# EAGLE design profile (EAGLE 7.7.0)
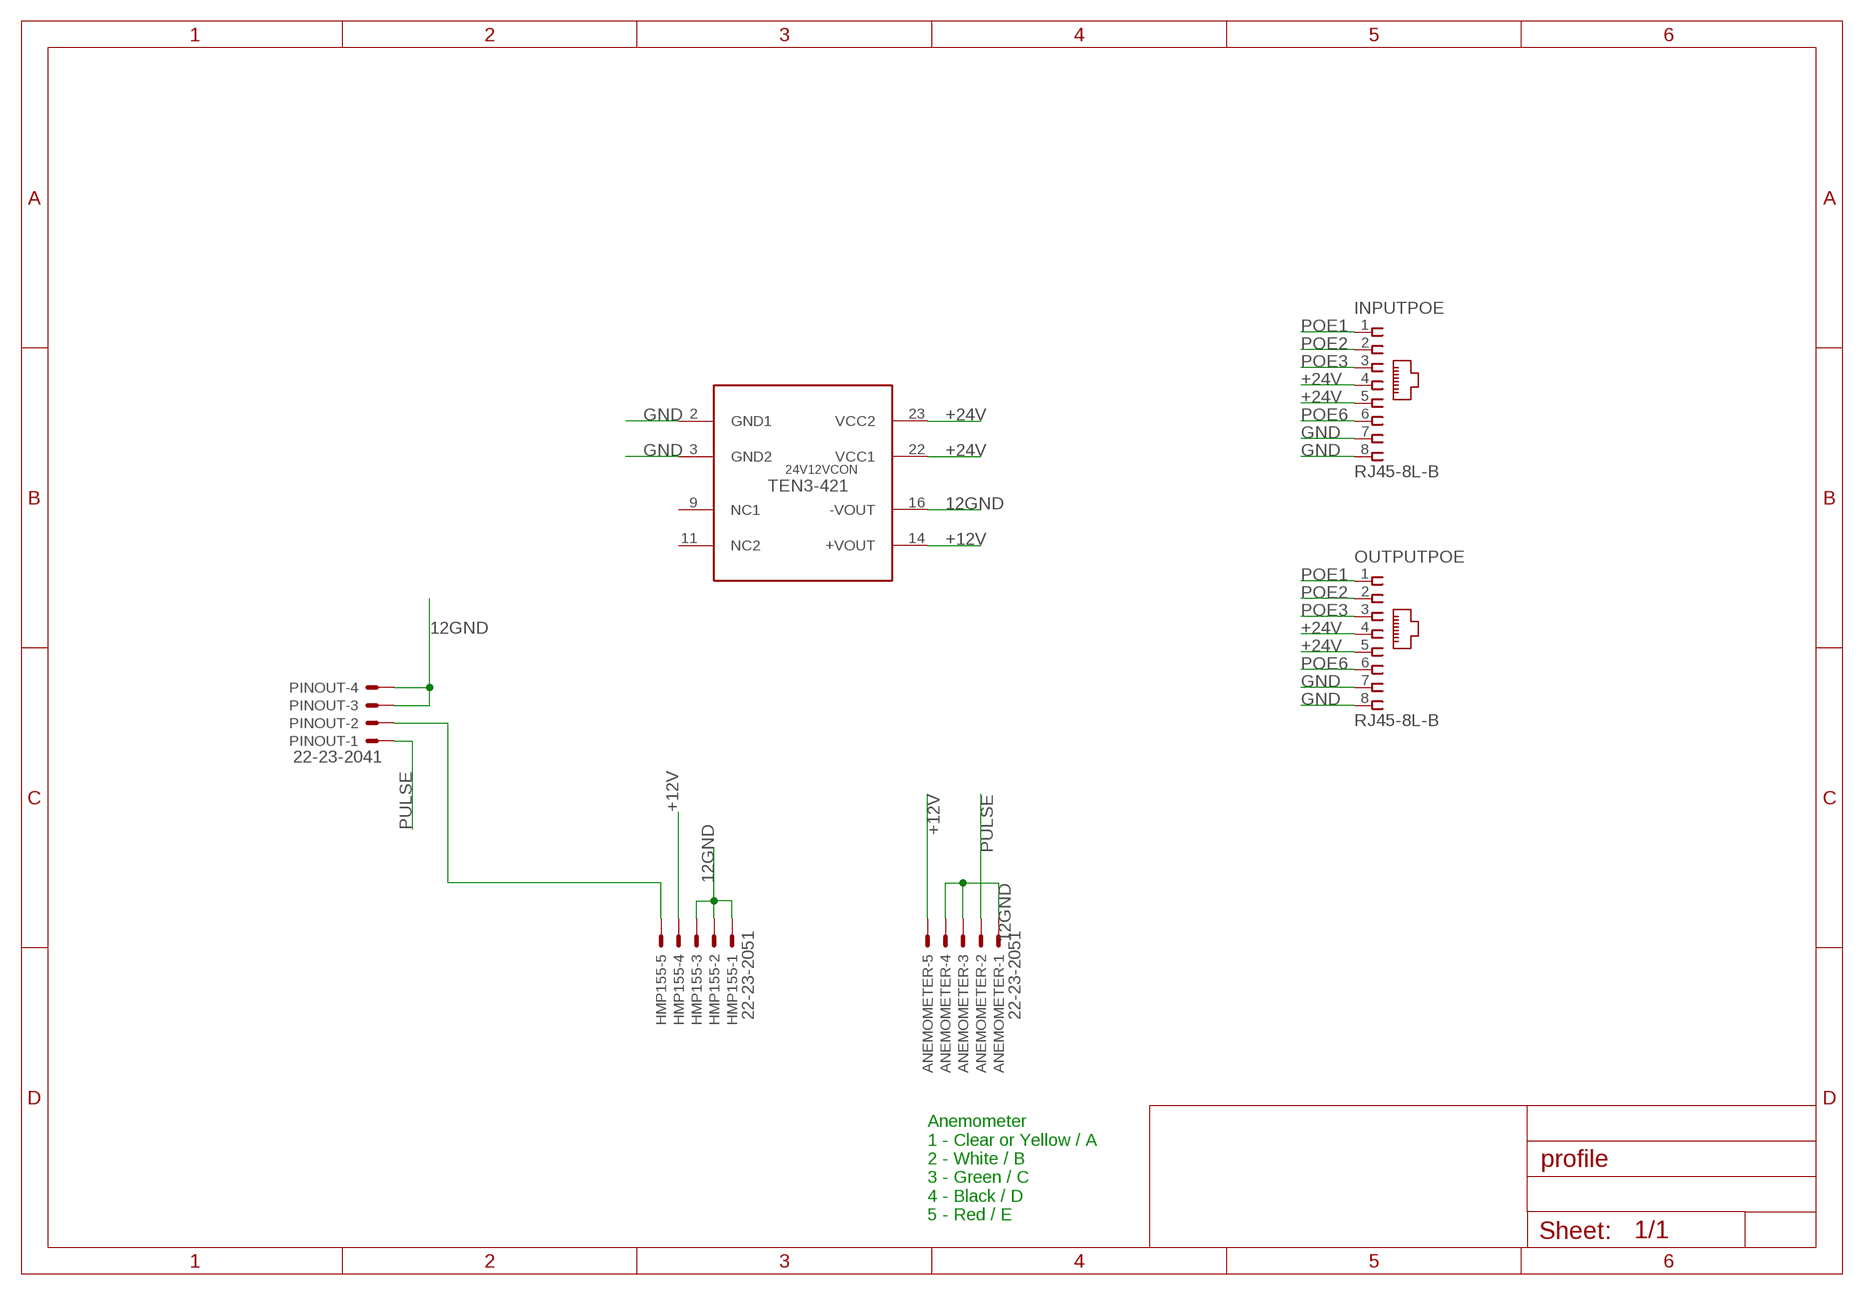
[diagram p0: schematic, sheet 1]

## Parts
24V12VCON  TEN3-421  [SOCKET-24-6]
ANEMOMETER  22-23-2051  [22-23-2051]
HMP155  22-23-2051  [22-23-2051]
INPUTPOE  RJ45-8L-B  [RJ45-NO-SHIELD]
OUTPUTPOE  RJ45-8L-B  [RJ45-NO-SHIELD]
PINOUT  22-23-2041  [22-23-2041]

## Nets
12GND: 24V12VCON.16(-VOUT) ANEMOMETER.1 ANEMOMETER.3 ANEMOMETER.4 HMP155.1 HMP155.2 HMP155.3 PINOUT.3 PINOUT.4
+12V: 24V12VCON.14(+VOUT) ANEMOMETER.5 HMP155.4
+24V: 24V12VCON.22(VCC1) 24V12VCON.23(VCC2) INPUTPOE.4 INPUTPOE.5 OUTPUTPOE.4 OUTPUTPOE.5
GND: 24V12VCON.2(GND1) 24V12VCON.3(GND2) INPUTPOE.7 INPUTPOE.8 OUTPUTPOE.7 OUTPUTPOE.8
N$4: HMP155.5 PINOUT.2
POE1: INPUTPOE.1 OUTPUTPOE.1
POE2: INPUTPOE.2 OUTPUTPOE.2
POE3: INPUTPOE.3 OUTPUTPOE.3
POE6: INPUTPOE.6 OUTPUTPOE.6
PULSE: ANEMOMETER.2 PINOUT.1
Unconnected: 24V12VCON.9(NC1) 24V12VCON.11(NC2)

## Notes on the sheet
- Anemometer
  1 - Clear or Yellow / A
  2 - White / B
  3 - Green / C
  4 - Black / D
  5 - Red / E

## Library data of the parts
24V12VCON = TRACO:TEN3-421
ANEMOMETER HMP155 = con-molex:22-23-2051: .100" (2.54mm) Center Header - 5 Pin; MF: MOLEX; MPN: 22-23-2051; OC_FARNELL: 1462952; OC_NEWARK: 38C9178
INPUTPOE OUTPUTPOE = con-tycoelectronics:RJ45: CORCOM Modular RJ Jacks No Shield Source: www.tycoelectronics.com .. ENG_DS_1654001_1099_RJ_L_0507.pdf; MF: TYCO ELECTRONICS; MPN: RJ45-8L-B; OC_FARNELL: 1279843; OC_NEWARK: 52K4445
PINOUT = con-molex:22-23-2041: .100" (2.54mm) Center Header - 4 Pin; MF: MOLEX; MPN: 22-23-2041; OC_FARNELL: 1462920; OC_NEWARK: 38C0355

## Net classes
0 default: width 0.152 mm, clearance 0.254 mm

## Board
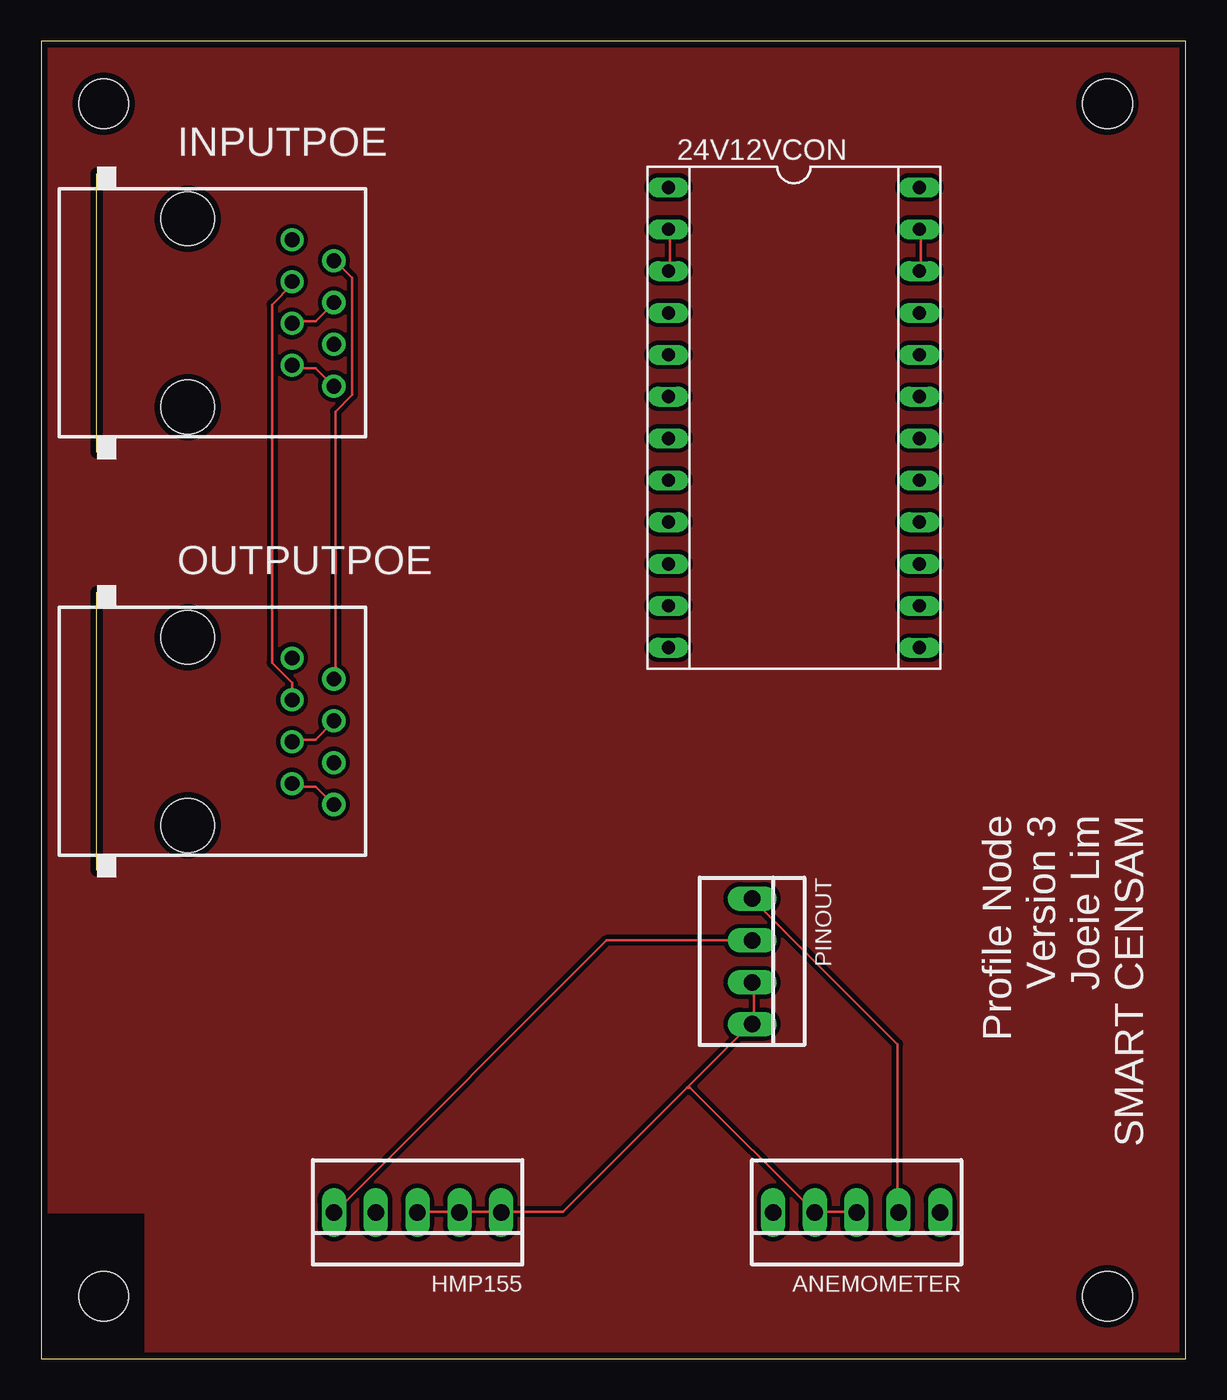
[diagram p1: board, top side]
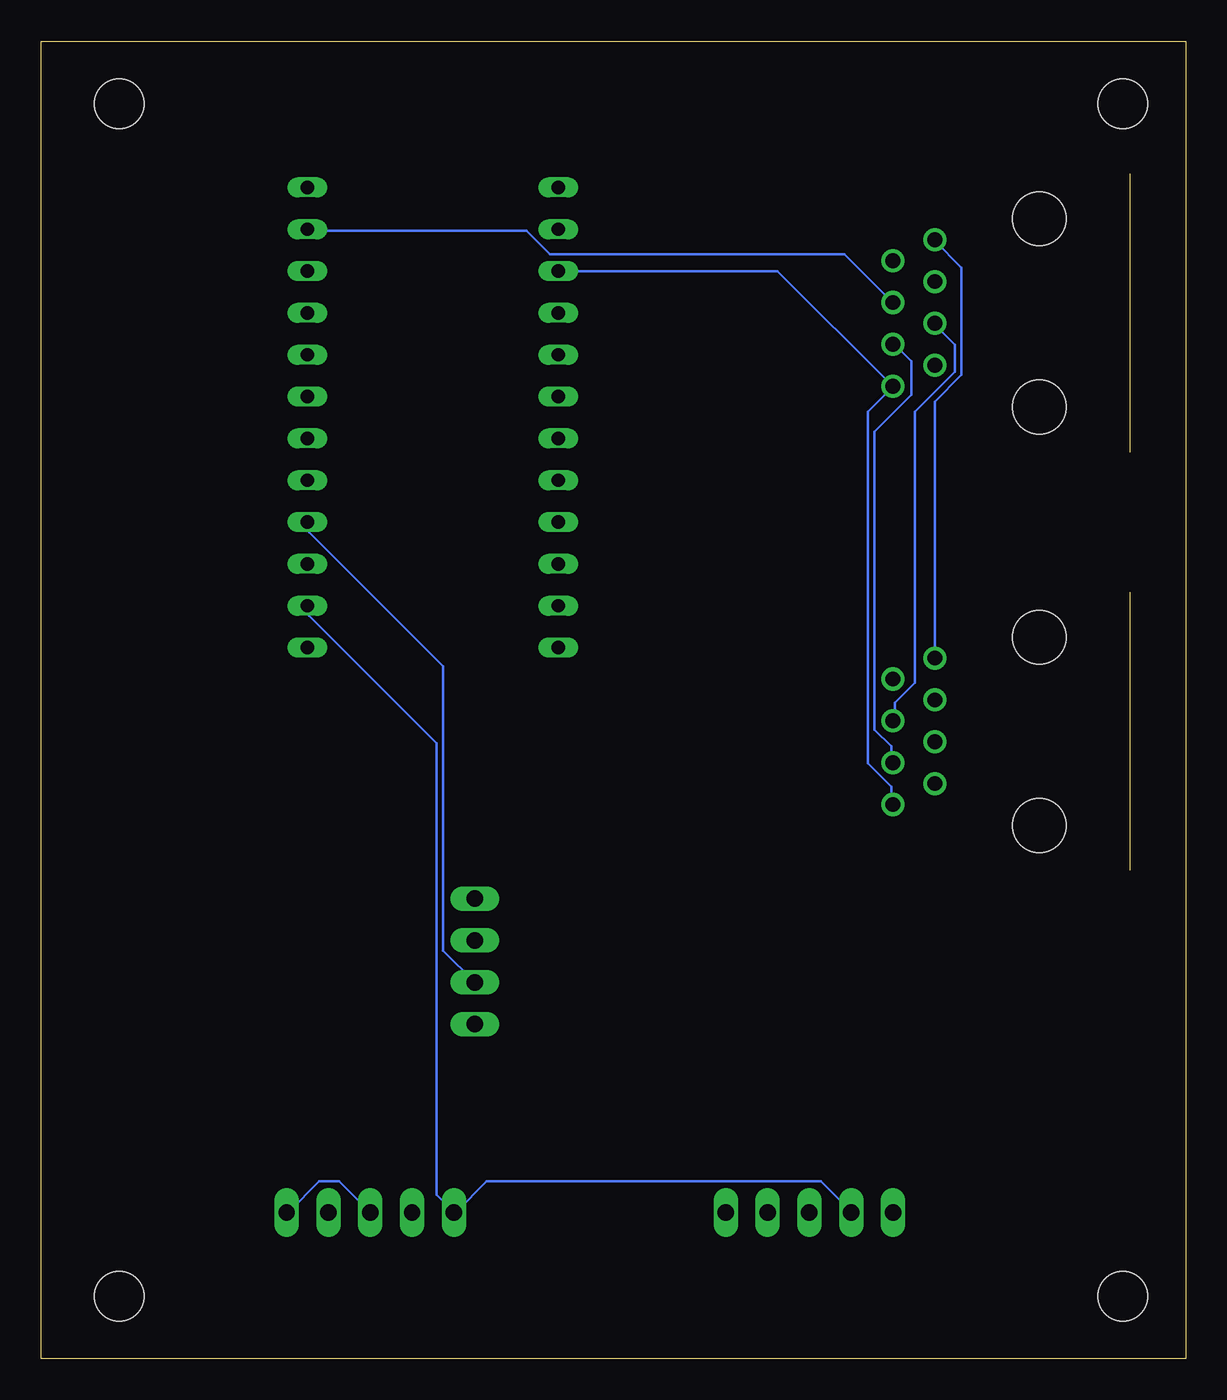
[diagram p2: board, bottom side, seen from below]

Size 69.52 x 80 mm. Coordinates in mm from the lower left corner, seen from the top.
Outline: 0,0 69.52,0 69.52,80 0,80 0,0
Copper layers (1*16): Top 0.0356mm / dielectric 1.5011mm / Bottom 0.0356mm
Design rules "default *": minimum track width 6mil, minimum drill 13mil, track to track 6mil, track to pad 6mil, pad to pad 6mil, via to via 6mil, smd to smd 6mil, copper to edge 15mil, drill to drill 6mil, minimum pad ring 7mil, minimum via ring 7mil, stop-mask expansion 3mil, vias tented up to drill 0mil, thermal gap 10mil
Holes 3 mm at 3.81,76.2 64.77,76.2 64.77,3.81 3.81,3.81

### Footprints (pad centres in the part's own frame; a part is rotated, then mirrored left to right if it is on the bottom)
SOCKET-24-6 = drill 0.813 long: 1 -13.97,-7.62; 2 -11.43,-7.62; 3 -8.89,-7.62; 4 -6.35,-7.62; 5 -3.81,-7.62; 6 -1.27,-7.62; 7 1.27,-7.62; 8 3.81,-7.62; 9 6.35,-7.62; 10 8.89,-7.62; 11 11.43,-7.62; 12 13.97,-7.62; 13 13.97,7.62; 14 11.43,7.62; 15 8.89,7.62; 16 6.35,7.62; 17 3.81,7.62; 18 1.27,7.62; 19 -1.27,7.62; 20 -3.81,7.62; 21 -6.35,7.62; 22 -8.89,7.62; 23 -11.43,7.62; 24 -13.97,7.62
22-23-2051 = drill 1 long: 1 -5.08,0; 2 -2.54,0; 3 0,0; 4 2.54,0; 5 5.08,0
RJ45-NO-SHIELD = drill 0.9 pad 1.4: 1 -4.445,6.35; 2 -3.175,8.89; 3 -1.905,6.35; 4 -0.635,8.89; 5 0.635,6.35; 6 1.905,8.89; 7 3.175,6.35; 8 4.445,8.89 | hole 3.251: -5.715,0; 5.715,0
22-23-2041 = drill 1 long: 1 -3.81,0; 2 -1.27,0; 3 1.27,0; 4 3.81,0

### Placement (x,y rotation side)
24V12VCON  45.72,57.15 270 top
ANEMOMETER  49.53,8.89 180 top
HMP155  22.86,8.89 180 top
INPUTPOE  8.89,63.5 270 top
OUTPUTPOE  8.89,38.1 270 top
PINOUT  43.18,24.13 270 top

### Tracks (layer width: path | path; a pad name or v marks a point on that pad's centre or on a via)
12GND
  Top 0.152: ANEMOMETER.3 49.38,8.94 47.14,8.94 ANEMOMETER.4 39.42,16.46 39.22,16.46 | 25.4,8.94 22.96,8.94 HMP155.3 | 25.4,8.94 27.84,8.94 HMP155.1 28.04,8.94 31.7,8.94 39.22,16.46 | 25.4,8.94 HMP155.2 | PINOUT.3 43.28,22.76 43.28,20.32 PINOUT.4 43.08,20.32 39.22,16.46
  Bottom 0.152: ANEMOMETER.3 51.41,10.77 52.63,10.77 54.46,8.94 ANEMOMETER.1 | PINOUT.3 45.11,24.79 45.11,42.06 53.24,50.19 53.24,50.8 24V12VCON.16
+12V
  Bottom 0.152: 24V12VCON.14 53.24,45.72 53.24,45.11 45.52,37.39 45.52,9.96 ANEMOMETER.5 44.3,8.94 42.47,10.77 22.15,10.77 20.32,8.94 HMP155.4
+24V
  Top 0.152: OUTPUTPOE.5 15.24,37.59 16.66,37.59 17.68,38.61 OUTPUTPOE.4 | 24V12VCON.22 53.44,66.04 53.44,68.48 24V12VCON.23 | INPUTPOE.5 15.24,62.99 16.66,62.99 17.68,64.01 INPUTPOE.4
  Bottom 0.152: 24V12VCON.23 53.24,68.48 40.03,68.48 38.61,67.06 20.73,67.06 17.88,64.21 INPUTPOE.4 | OUTPUTPOE.4 17.68,38.81 17.68,39.83 16.46,41.05 16.46,57.51 14.02,59.94 14.02,61.57 15.24,62.79 INPUTPOE.5
GND
  Top 0.152: OUTPUTPOE.7 15.24,34.75 16.66,34.75 17.68,33.73 OUTPUTPOE.8 | 24V12VCON.3 38.2,66.04 38.2,68.48 24V12VCON.2 | INPUTPOE.7 15.24,60.15 16.66,60.15 17.68,59.13 INPUTPOE.8
  Bottom 0.152: 24V12VCON.3 24.79,66.04 17.88,59.13 INPUTPOE.8 17.88,58.93 19.3,57.51 19.3,36.17 17.88,34.75 17.88,33.73 OUTPUTPOE.8
N$1
  pour Top: 0,80.01 69.85,80.01 69.85,0 6.35,0 6.35,8.89 0,8.89
N$4
  Top 0.152: PINOUT.2 34.34,25.4 17.88,8.94 HMP155.5
POE1
  Bottom 0.152: OUTPUTPOE.1 15.24,58.12 13.61,59.74 13.61,66.24 15.24,67.87 INPUTPOE.1
POE2
  Top 0.152: OUTPUTPOE.2 17.88,41.45 17.88,57.51 18.9,58.52 18.9,65.63 17.88,66.65 INPUTPOE.2
POE3
  Top 0.152: OUTPUTPOE.3 15.24,41.05 14.02,42.27 14.02,64.01 15.24,65.23 INPUTPOE.3
POE6
  Bottom 0.152: OUTPUTPOE.6 17.88,36.37 17.88,37.19 18.9,38.2 18.9,56.29 16.66,58.52 16.66,60.55 17.68,61.57 INPUTPOE.6
PULSE
  Top 0.152: PINOUT.1 52.02,19.1 52.02,8.94 ANEMOMETER.2

### Text on the board
tNames: Profile Node / Version 3 / Joeie Lim / SMART CENSAM